# EAGLE schematic 7segment multiplex (EAGLE 6.0)
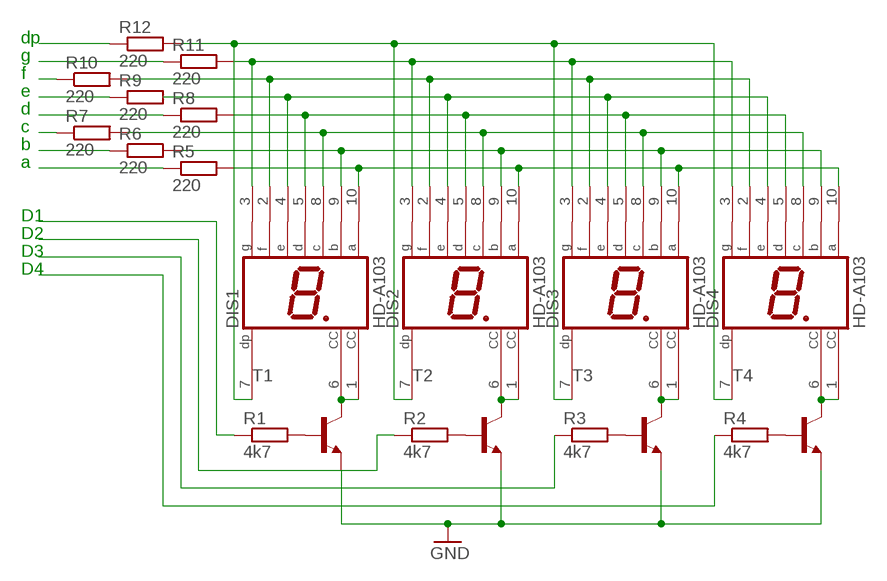
[diagram p0: schematic, sheet 1]

## Parts
DIS1  HD-A103  [HDSP-A]
DIS2  HD-A103  [HDSP-A]
DIS3  HD-A103  [HDSP-A]
DIS4  HD-A103  [HDSP-A]
R1  4k7  R-EU_0204/7  [0204/7]
R2  4k7  R-EU_0204/7  [0204/7]
R3  4k7  R-EU_0204/7  [0204/7]
R4  4k7  R-EU_0204/7  [0204/7]
R5  220  R-EU_0204/7  [0204/7]
R6  220  R-EU_0204/7  [0204/7]
R7  220  R-EU_0204/7  [0204/7]
R8  220  R-EU_0204/7  [0204/7]
R9  220  R-EU_0204/7  [0204/7]
R10  220  R-EU_0204/7  [0204/7]
R11  220  R-EU_0204/7  [0204/7]
R12  220  R-EU_0204/7  [0204/7]
T1  -NPN-TO92  [TO92]
T2  -NPN-TO92  [TO92]
T3  -NPN-TO92  [TO92]
T4  -NPN-TO92  [TO92]

## Nets
GND: T1.1(E) T2.1(E) T3.1(E) T4.1(E)
N$1: DIS1.10(A) DIS2.10(A) DIS3.10(A) DIS4.10(A) R5.2
N$2: DIS1.9(B) DIS2.9(B) DIS3.9(B) DIS4.9(B) R6.2
N$3: DIS1.8(C) DIS2.8(C) DIS3.8(C) DIS4.8(C) R7.2
N$4: DIS1.5(D) DIS2.5(D) DIS3.5(D) DIS4.5(D) R8.2
N$5: DIS1.4(E) DIS2.4(E) DIS3.4(E) DIS4.4(E) R9.2
N$6: DIS1.2(F) DIS2.2(F) DIS3.2(F) DIS4.2(F) R10.2
N$7: DIS1.3(G) DIS2.3(G) DIS3.3(G) DIS4.3(G) R11.2
N$8: DIS1.7(DP) DIS2.7(DP) DIS3.7(DP) DIS4.7(DP) R12.2
N$9: DIS1.1(CC) DIS1.6(CC) T1.3(C)
N$10: DIS2.1(CC) DIS2.6(CC) T2.3(C)
N$11: DIS3.1(CC) DIS3.6(CC) T3.3(C)
N$12: DIS4.1(CC) DIS4.6(CC) T4.3(C)
N$13: R1.2 T1.2(B)
N$14: R2.2 T2.2(B)
N$15: R3.2 T3.2(B)
N$16: R4.2 T4.2(B)
N$17: R5.1
N$18: R6.1
N$19: R7.1
N$20: R8.1
N$21: R2.1
N$22: R11.1
N$23: R9.1
N$24: R10.1
N$25: R12.1
N$26: R4.1
N$27: R3.1
N$28: R1.1

## Notes on the sheet
- dp
- g
- f
- e
- d
- c
- b
- a
- D1
- D2
- D3
- D4

## Library data of the parts
DIS1-DIS4 = display-hp:HD-A103: LED DISPLAY 1-character 7 segment, decimal point right; OC_FARNELL: unknown; OC_NEWARK: unknown
R1-R12 = rcl:R-EU_: RESISTOR, European symbol
T1-T4 = transistor:*-NPN-: NPN Transistror BF959 corrected 2008.03.06